# Altium schematic sheet BlockDiagram.SchDoc: <title>
size A4; Organization: Institut d'Automatisation Industrielle; SheetNumber: 2; SheetTotal: 3; SVN: OUI; CurrentTime: 6; CurrentDate: 5; DocumentFullPathAndName: 8; DocumentName: 9; ModifiedDate: 13; ProjectName: <projet>
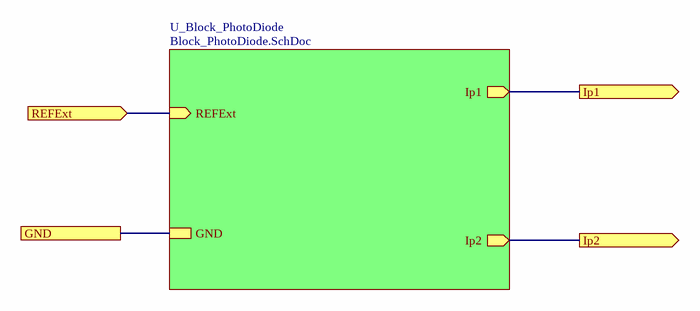
[diagram p0: BlockDiagram.SchDoc]

## Sub-sheets
U_Block_PhotoDiode = Block_PhotoDiode.SchDoc: Ip1 (out), Ip2 (out), REFExt (in), GND

## Ports
GND, Ip1 (out), Ip2 (out), REFExt (in)

## Nets
GND: port GND, sheet U_Block_PhotoDiode/GND
Ip1: port Ip1, sheet U_Block_PhotoDiode/Ip1
Ip2: port Ip2, sheet U_Block_PhotoDiode/Ip2
REFExt: port REFExt, sheet U_Block_PhotoDiode/REFExt

## Notes on the sheet
- Title
- Institut d'automatisation industrielle
  rte de Cheseaux 1
  CH-1401 Yverdon-les-Bains
  T +41(0)24 55 77 377    F +41(0)24 55 76 320
  http://iai.heig-vd.ch       iai@heig-vd.ch
- Date:
- Size:
- A4
- Project:
- Sheet
- of
- No.
- Author:
- SVN
- Version
- File: